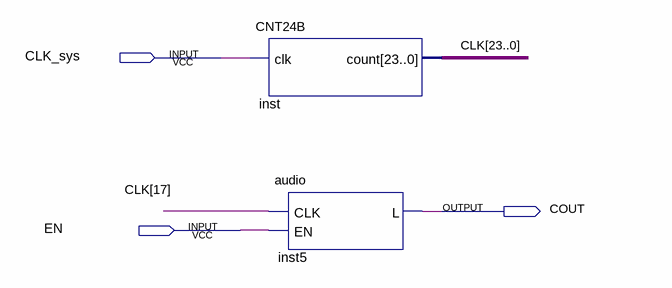
[diagram p0: schematic sheet]
// Quartus schematic systhisis.bdf as structural Verilog: 2 symbols, 3 pins
module systhisis (
  input  CLK_sys,
  input  EN,
  output COUT
);

  wire [23:0] CLK;

  CNT24B inst (.clk(CLK_sys), .count(CLK));
  audio inst5 (.CLK(CLK[17]), .EN(EN), .L(COUT));
endmodule
